# Altium project brew.PrjPcb
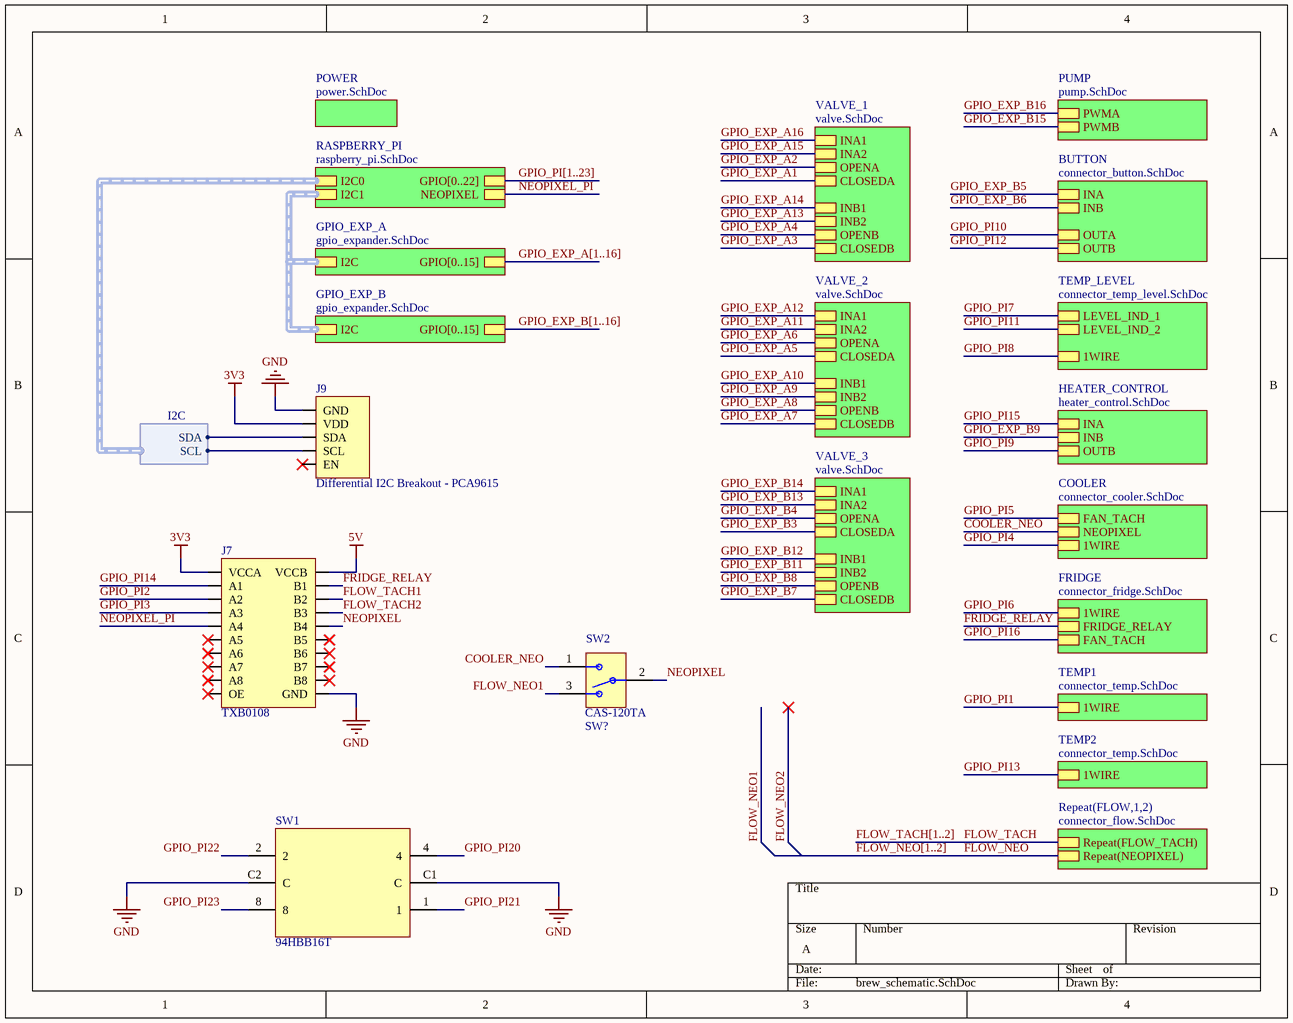
[diagram p0: brew_schematic.SchDoc]
15 sheets, 45 parts. Net scope: hierarchical (ports join the sheet entries above them; power ports are global).
Board file: brew_cad.PcbDoc
Sheets:
  brew_schematic.SchDoc
    POWER = power.SchDoc
    RASPBERRY_PI = raspberry_pi.SchDoc
    PUMP = pump.SchDoc
      Pump Connector B = connector_pump.SchDoc
      Pump Connector A = connector_pump.SchDoc
    TEMP_LEVEL = connector_temp_level.SchDoc
    HEATER_CONTROL = heater_control.SchDoc
    COOLER = connector_cooler.SchDoc
    GPIO_EXP_A = gpio_expander.SchDoc
    GPIO_EXP_B = gpio_expander.SchDoc
    FRIDGE = connector_fridge.SchDoc
    TEMP1 = connector_temp.SchDoc
    FLOW1 = connector_flow.SchDoc
    FLOW2 = connector_flow.SchDoc
    BUTTON = connector_button.SchDoc
    VALVE_1 = valve.SchDoc
      VALVE_CONN = connector_valve.SchDoc
      VALVE_CONN = connector_valve.SchDoc
    VALVE_2 = valve.SchDoc
      VALVE_CONN = connector_valve.SchDoc
      VALVE_CONN = connector_valve.SchDoc
    VALVE_3 = valve.SchDoc
      VALVE_CONN = connector_valve.SchDoc
      VALVE_CONN = connector_valve.SchDoc
    TEMP2 = connector_temp.SchDoc

## Sheet brew_schematic.SchDoc: Monk
size A

### Parts
J7  TXB0108  [TXB0108]
J9  Differential I2C Breakout - PCA9615  [Differential I2C Breakout - PCA9615]
SW1  MFG P/N: 94HBB16T  [SW_HEX_ROTARY_94HBB16T]  (hidden comment: SWITCH_HEX ROTARY_50V_DIP16)
SW2  MFG P/N: CAS-120TA  Designator: SW?  [SWITCH_CAS-120TA]  (hidden comment: SWITCH_DIP_SPDT_CAS-120TA)

### Sub-sheets
BUTTON = connector_button.SchDoc: INA, INB, OUTB, OUTA
COOLER = connector_cooler.SchDoc: NEOPIXEL, FAN_TACH, 1WIRE
FRIDGE = connector_fridge.SchDoc: FRIDGE_RELAY, 1WIRE, FAN_TACH
GPIO_EXP_A = gpio_expander.SchDoc: GPIO[0..15], I2C (harness I2C)
GPIO_EXP_B = gpio_expander.SchDoc: GPIO[0..15], I2C (harness I2C)
HEATER_CONTROL = heater_control.SchDoc: INA, INB, OUTB
POWER = power.SchDoc: no entries
PUMP = pump.SchDoc: PWMB, PWMA
RASPBERRY_PI = raspberry_pi.SchDoc: I2C1 (harness I2C), I2C0 (harness I2C), GPIO[0..22], NEOPIXEL
Repeat(FLOW,1,2) = connector_flow.SchDoc: Repeat(FLOW_TACH), Repeat(NEOPIXEL)
TEMP1 = connector_temp.SchDoc: 1WIRE
TEMP2 = connector_temp.SchDoc: 1WIRE
TEMP_LEVEL = connector_temp_level.SchDoc: 1WIRE, LEVEL_IND_2, LEVEL_IND_1
VALVE_1 = valve.SchDoc: CLOSEDB, INA2, OPENB, OPENA, CLOSEDA, INB2, INB1, INA1
VALVE_2 = valve.SchDoc: CLOSEDB, INA2, OPENB, OPENA, CLOSEDA, INB2, INB1, INA1
VALVE_3 = valve.SchDoc: CLOSEDB, INA2, OPENB, OPENA, CLOSEDA, INB2, INB1, INA1

### Harnesses
I2C: SDA, SCL

### Nets
3V3: J7.1(VCCA) J9.2(VDD)
5V: J7.20(VCCB)
GND: J7.11(GND) J9.1(GND) SW1.C1(C) SW1.C2(C)
COOLER_NEO: SW2.1 ; sheet COOLER/NEOPIXEL
FLOW_NEO: sheet Repeat(FLOW,1,2)/Repeat(NEOPIXEL)
FLOW_NEO1: SW2.3
FLOW_TACH: sheet Repeat(FLOW,1,2)/Repeat(FLOW_TACH)
FLOW_TACH1: J7.18(B2)
FLOW_TACH2: J7.17(B3)
FRIDGE_RELAY: J7.19(B1) ; sheet FRIDGE/FRIDGE_RELAY
GPIO_PI2: J7.3(A2)  [project net GPIO1]
GPIO_PI3: J7.4(A3)  [project net GPIO2]
GPIO_PI14: J7.2(A1)  [project net GPIO13]
GPIO_PI20: SW1.4  [project net GPIO19]
GPIO_PI21: SW1.1  [project net GPIO20]
GPIO_PI22: SW1.2  [project net GPIO21]
GPIO_PI23: SW1.8  [project net GPIO22]
I2C0_SCL: J9.4(SCL) ; sheet RASPBERRY_PI/I2C0.SCL
I2C0_SDA: J9.3(SDA) ; sheet RASPBERRY_PI/I2C0.SDA
NEOPIXEL: J7.16(B4) SW2.2
NEOPIXEL_PI: J7.5(A4) ; sheet RASPBERRY_PI/NEOPIXEL

Not connected (* = marked no-connect by the designer): J7 6(A5)* 7(A6)* 8(A7)* 9(A8)* 10(OE)* 12(B8)* 13(B7)* 14(B6)* 15(B5)*; J9 5(EN)*

### Buses and harness runs
bus FLOW_NEO[1..2]
bus FLOW_TACH[1..2]
bus GPIO_EXP_A[1..16] = sheet GPIO_EXP_A/GPIO[0..15]
bus GPIO_EXP_B[1..16] = sheet GPIO_EXP_B/GPIO[0..15]
bus GPIO_PI[1..23] = sheet RASPBERRY_PI/GPIO[0..22]
harness sheet GPIO_EXP_A/I2C = sheet GPIO_EXP_B/I2C = sheet RASPBERRY_PI/I2C1

### Library data of the parts
SW1 = 89: SWITCH ROTARY DIP HEX 100MA 50V; ID: 89; MFG: GRAYHILL; COMMON: 510-00168-00; XPN: XS-10020997; Status: In Development; ComponentLink1Description: Datasheet; ComponentLink1URL: http://www.digikey.com/products/en?keywords=94HBB16T; LOON: 510-00168-00; Gecko: 510-00168-00
SW2 = 38: SLIDE SWITCH SPDT J HOOK 6V; ID: 38; MFG: Copal Electronics Inc; COMMON: 510-00158-00; XPN: XS-10020994; Status: In Development; Category: Switches; RoHS Compliant: Yes; Supplier 1: Digi-Key; Mounting Type: Surface Mount; HelpURL: http://copal-electronics.info/en/0008e/02462.pdf; ComponentLink1Description: Datasheet; ComponentLink1URL: http://copal-electronics.info/en/0008e/02462.pdf; LOON: 510-00158-00; Gecko: 510-00158-00; Supplier Part Number 1: CAS120JCT-ND

## Sheet power.SchDoc
size A
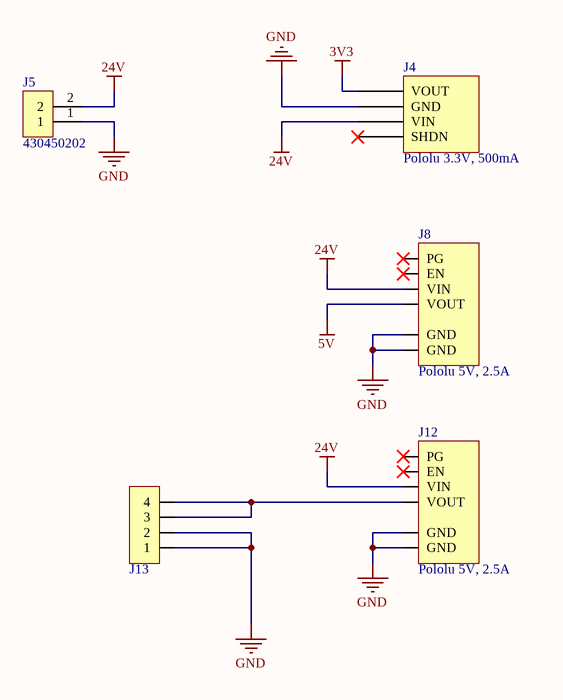
[diagram p1: power.SchDoc]

### Parts
J4  Pololu 3.3V, 500mA  [Pololu 3.3V, 500mA Step-Down Voltage Regulator D24V5F3 - duplicate]
J5  MFG P/N: 430450202  [MOLEX_430450202]  (hidden comment: __Template_Connector_1X2)
J8  Pololu 5V, 2.5A  [Pololu 5V, 2.5A Step-Down Voltage Regulator D24V22F5]
J12  Pololu 5V, 2.5A  [Pololu 5V, 2.5A Step-Down Voltage Regulator D24V22F5]
J13  1x4_PIN  [1x4_PIN]  (value not drawn)

### Nets
3V3: J4.1(VOUT)
5V: J8.5(VOUT)
24V: J4.3(VIN) J5.2 J8.3(VIN) J12.3(VIN)
GND: J4.2(GND) J5.1 J8.4(GND) J8.6(GND) J12.4(GND) J12.6(GND) J13.1 J13.2
NetJ12_5: J12.5(VOUT) J13.3 J13.4

Not connected (* = marked no-connect by the designer): J4 4(SHDN)*; J8 1(PG)* 2(EN)*; J12 1(PG)* 2(EN)*

### Library data of the parts
J4 = Pololu 3.3V, 500mA Step-Down Voltage Regulator D24V5F3
J5 = 958: CONN, HDR, R/A, 2x1, 3MM P, 7.37MM H, GOLD, TH; ID: 958; MFG: Molex, LLC; Connector Type: Header; Pitch: 3.00mm; Number of Positions: 2; Gender: Male; Current Rating: 8A; Voltage, Rated: 600V; Status: Released; RoHS Compliant: Yes; Mounting Type: Through Hole; Orientation: Right Angle; Number of Rows: 1; Features: Board Lock; Supplier 1: Digi-Key; HelpURL: https://www.digikey.in/product-detail/en/molex-llc/0430450202/WM1819-ND/252532; ComponentLink1Description: Datasheet; ComponentLink1URL: https://www.molex.com/pdm_docs/sd/430450202_sd.pdf; Supplier Part Number 1: WM1819-ND
J8 J12 = Pololu 5V, 2.5A Step-Down Voltage Regulator D24V22F5

## Sheet raspberry_pi.SchDoc
size A
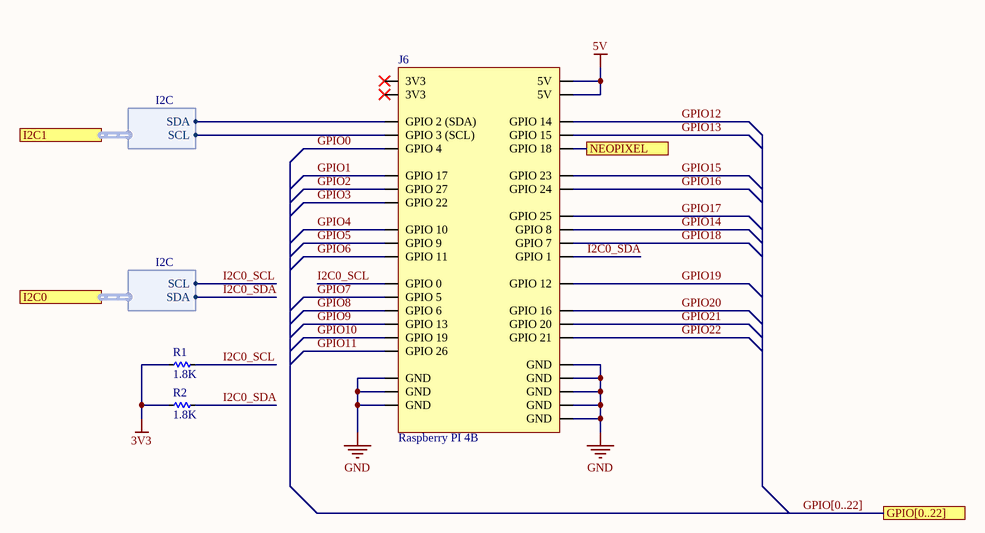
[diagram p2: raspberry_pi.SchDoc]

### Parts
J6  Raspberry PI 4B  [Raspberry PI 4B]
R1  value 1.8K  [R1206]  (hidden comment: __Template_Resistor)
R2  value 1.8K  [R1206]  (hidden comment: __Template_Resistor)

### Ports
GPIO[0..22], I2C0 (harness I2C), I2C1 (harness I2C), NEOPIXEL

### Harnesses
I2C: SDA, SCL

### Nets
3V3: R1.1 R2.1
5V: J6.2(5V) J6.4(5V)
GND: J6.6(GND) J6.9(GND) J6.14(GND) J6.20(GND) J6.25(GND) J6.30(GND) J6.34(GND) J6.39(GND)
GPIO0: J6.7(GPIO_4)
GPIO1: J6.11(GPIO_17)
GPIO2: J6.13(GPIO_27)
GPIO3: J6.15(GPIO_22)
GPIO4: J6.19(GPIO_10)
GPIO5: J6.21(GPIO_9)
GPIO6: J6.23(GPIO_11)
GPIO7: J6.29(GPIO_5)
GPIO8: J6.31(GPIO_6)
GPIO9: J6.33(GPIO_13)
GPIO10: J6.35(GPIO_19)
GPIO11: J6.37(GPIO_26)
GPIO12: J6.8(GPIO_14)
GPIO13: J6.10(GPIO_15)
GPIO14: J6.24(GPIO_8)
GPIO15: J6.16(GPIO_23)
GPIO16: J6.18(GPIO_24)
GPIO17: J6.22(GPIO_25)
GPIO18: J6.26(GPIO_7)
GPIO19: J6.32(GPIO_12)
GPIO20: J6.36(GPIO_16)
GPIO21: J6.38(GPIO_20)
GPIO22: J6.40(GPIO_21)
I2C0_SCL: J6.27(GPIO_0) R1.2 ; port I2C0.SCL
I2C0_SDA: J6.28(GPIO_1) R2.2 ; port I2C0.SDA
NEOPIXEL_PI: J6.12(GPIO_18) ; port NEOPIXEL
SCL: J6.5(GPIO_3_(SCL)) ; port I2C1.SCL
SDA: J6.3(GPIO_2_(SDA)) ; port I2C1.SDA

Not connected (* = marked no-connect by the designer): J6 1(3V3)* 17(3V3)*

### Buses and harness runs
bus GPIO[0..22] = port GPIO[0..22]

### Library data of the parts
R1 R2 = 3502: Resistor, 1.80K Ohms, 1206, 0.25W, ±1%; ID: 3502; MFG: YAGEO; MFG P/N: RC1206FR-071K8L; Power: 1/4W; COMMON: 470-06908-00; XPN: XS-10017648; Status: Released; Package: 1206; Tolerance: 1%; Height: 0.65mm; Supplier 1: Digi-Key; LOON: 470-06908-00; Gecko: 470-06908-00; Supplier Part Number 1: 311-1.80KFRCT-ND

## Sheet pump.SchDoc
size A
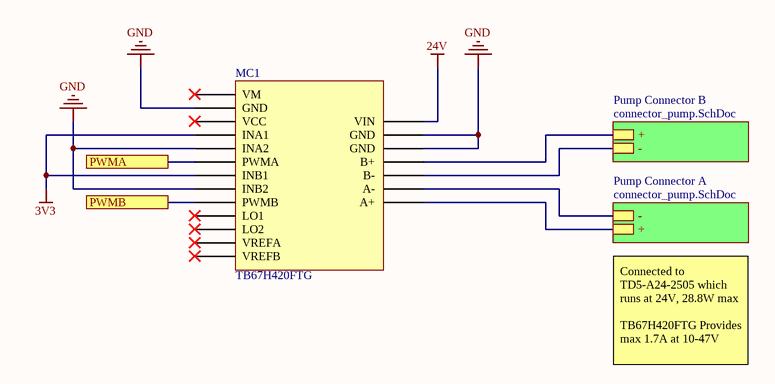
[diagram p3: pump.SchDoc]

### Parts
MC1  TB67H420FTG  [TB67H420FTG Dual/Single Motor Driver Carrier]

### Sub-sheets
Pump Connector A = connector_pump.SchDoc: +, -
Pump Connector B = connector_pump.SchDoc: +, -

### Ports
PWMA, PWMB

### Nets
3V3: MC1.4(INA1) MC1.7(INB1)
24V: MC1.20(VIN)
GND: MC1.2(GND) MC1.5(INA2) MC1.8(INB2) MC1.18(GND) MC1.19(GND)
GPIO14: MC1.9(PWMB) ; port PWMB
GPIO15: MC1.6(PWMA) ; port PWMA
NetCN1_Pump_Connector_A_1: MC1.14(A+) ; sheet Pump Connector A/+
NetCN1_Pump_Connector_A_2: MC1.15(A-) ; sheet Pump Connector A/-
NetCN1_Pump_Connector_B_1: MC1.17(B+) ; sheet Pump Connector B/+
NetCN1_Pump_Connector_B_2: MC1.16(B-) ; sheet Pump Connector B/-

Not connected (* = marked no-connect by the designer): MC1 1(VM)* 3(VCC)* 10(LO1)* 11(LO2)* 12(VREFA)* 13(VREFB)*

### Notes on the sheet
- Connected to TD5-A24-2505 which runs at 24V, 28.8W max
  TB67H420FTG Provides max 1.7A at 10-47V

### Library data of the parts
MC1 = TB67H420FTG Dual/Single Motor Driver Carrier

## Sheet connector_pump.SchDoc
size A
Used 2 times, as channels PUMP/Pump Connector B, PUMP/Pump Connector A. Parts and nets are listed once, with the designators drawn on the sheet.
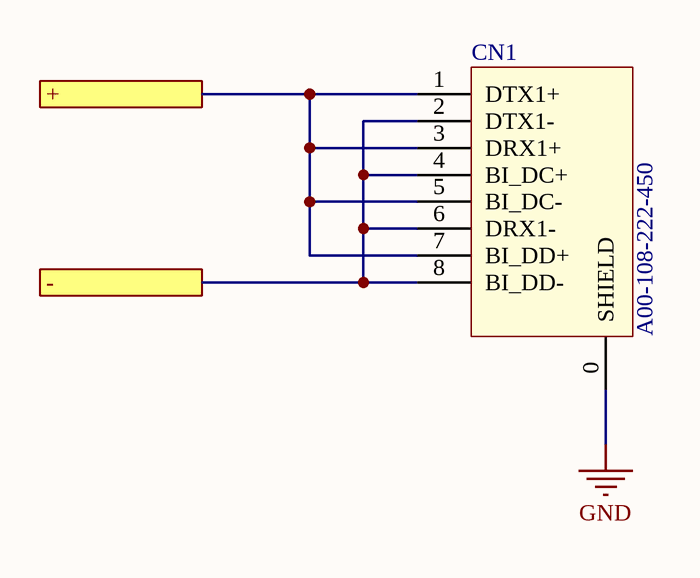
[diagram p4: connector_pump.SchDoc]

### Parts
CN1  MFG P/N: A00-108-222-450  [RJ45 TOP ENTRY EDAC A00-108-222-450]  (hidden comment: CONN_RJ45_TOP_A00-108-222-450)

### Ports
+, -

### Nets
GND: CN1.0(SHIELD)
+: CN1.1(DTX1+) CN1.3(DRX1+) CN1.5(BI_DC-) CN1.7(BI_DD+) ; port +
-: CN1.2(DTX1-) CN1.4(BI_DC+) CN1.6(DRX1-) CN1.8(BI_DD-) ; port -

### Channels
PUMP/Pump Connector B: designators end in _Pump_Connector_B; ports +=NetCN1_Pump_Connector_B_1 -=NetCN1_Pump_Connector_B_2
PUMP/Pump Connector A: designators end in _Pump_Connector_A; ports +=NetCN1_Pump_Connector_A_1 -=NetCN1_Pump_Connector_A_2

### Library data of the parts
CN1 = 492: CONN, RJ-45, 1-PORT, 8-POS, VERT, 0.76um GOLD, TH; ID: 492; MFG: EDAC Inc; COMMON: 210-00203-00; XPN: XS-10003929; Status: In Development; RoHS Compliant: Yes; LOON: 210-00203-00; Gecko: 210-00203-00

## Sheet connector_temp_level.SchDoc
size A
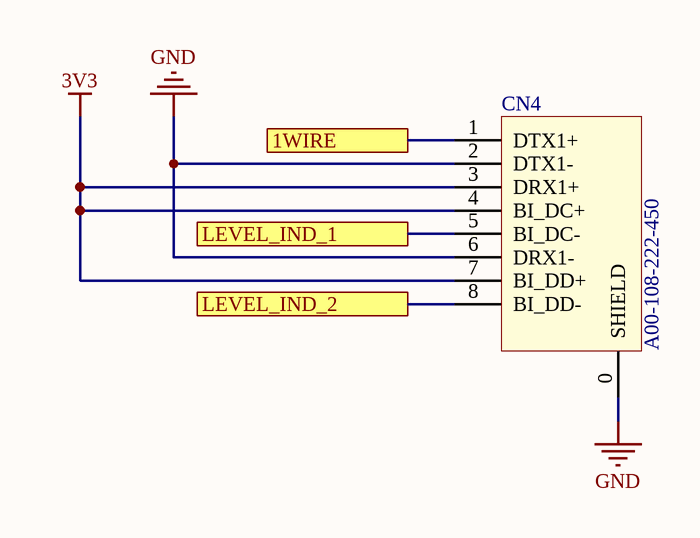
[diagram p5: connector_temp_level.SchDoc]

### Parts
CN4  MFG P/N: A00-108-222-450  [RJ45 TOP ENTRY EDAC A00-108-222-450]  (hidden comment: CONN_RJ45_TOP_A00-108-222-450)

### Ports
1WIRE, LEVEL_IND_1, LEVEL_IND_2

### Nets
3V3: CN4.3(DRX1+) CN4.4(BI_DC+) CN4.7(BI_DD+)
GND: CN4.0(SHIELD) CN4.2(DTX1-) CN4.6(DRX1-)
GPIO6: CN4.5(BI_DC-) ; port LEVEL_IND_1
GPIO7: CN4.1(DTX1+) ; port 1WIRE
GPIO10: CN4.8(BI_DD-) ; port LEVEL_IND_2

### Library data of the parts
CN4 = 492: as CN1 on sheet connector_pump; Status: In Development; RoHS Compliant: Yes; LOON: 210-00203-00; Gecko: 210-00203-00

## Sheet heater_control.SchDoc
size A
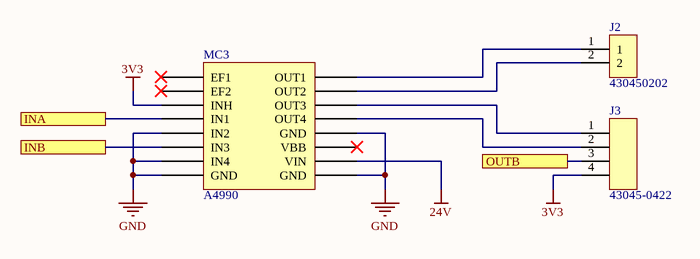
[diagram p6: heater_control.SchDoc]

### Parts
J2  MFG P/N: 430450202  [MOLEX_430450202]  (hidden comment: __Template_Connector_1X2)
J3  MFG P/N: 43045-0422  [MOLEX_MICROFIT_DOUBLE_ROW_RA_TH_4POS_43045-0422]  (hidden comment: CONN_MOLEX_MICROFIT_DOUBLE_ROW_RA_TH_4POS_LOCK)
MC3  A4990  [A4990 Dual Motor Driver Carrier]

### Ports
INA, INB, OUTB

### Nets
3V3: J3.4 MC3.3(INH)
24V: MC3.10(VIN)
GND: MC3.5(IN2) MC3.7(IN4) MC3.8(GND) MC3.9(GND) MC3.12(GND)
GPIO8: J3.3 ; port OUTB
GPIO8: MC3.6(IN3) ; port INB  [a separate net that carries the same name]
GPIO14: MC3.4(IN1) ; port INA
NetJ2_1: J2.1 MC3.16(OUT1)
NetJ2_2: J2.2 MC3.15(OUT2)
NetJ3_1: J3.1 MC3.14(OUT3)
NetJ3_2: J3.2 MC3.13(OUT4)

Not connected (* = marked no-connect by the designer): MC3 1(EF1)* 2(EF2)* 11(VBB)*

### Library data of the parts
J2 = 958: as J5 on sheet power; Status: Released; RoHS Compliant: Yes; Mounting Type: Through Hole; Orientation: Right Angle; Number of Rows: 1; Features: Board Lock; Supplier 1: Digi-Key; HelpURL: https://www.digikey.in/product-detail/en/molex-llc/0430450202/WM1819-ND/252532; ComponentLink1Description: Datasheet; ComponentLink1URL: https://www.molex.com/pdm_docs/sd/430450202_sd.pdf; Supplier Part Number 1: WM1819-ND
J3 = 164: CONN MOLEX MICROFIT 4POS RA GOLD; ID: 164; MFG: Molex Inc; Pitch: 3.00mm (0.118"); Number of Positions: 4; Gender: Male; COMMON: 210-00301-00; Status: In-Development; RoHS Compliant: Yes; Mounting Type: Through Hole; Orientation: Right Angle; Number of Rows: 2; Row Spacing: 3.00mm (0.118"); Features: Board Lock, Locking Ramp, Shrouded; Supplier 1: Digi-Key; HelpURL: http://www.molex.com/pdm_docs/sd/430450221_sd.pdf; ComponentLink1Description: Datasheet; ComponentLink1URL: http://www.molex.com/pdm_docs/sd/430450221_sd.pdf; LOON: 210-00301-00; XPN: 210-00301-00; Gecko: 210-00301-00
MC3 = A4990 Dual Motor Driver Carrier

## Sheet connector_cooler.SchDoc
size A
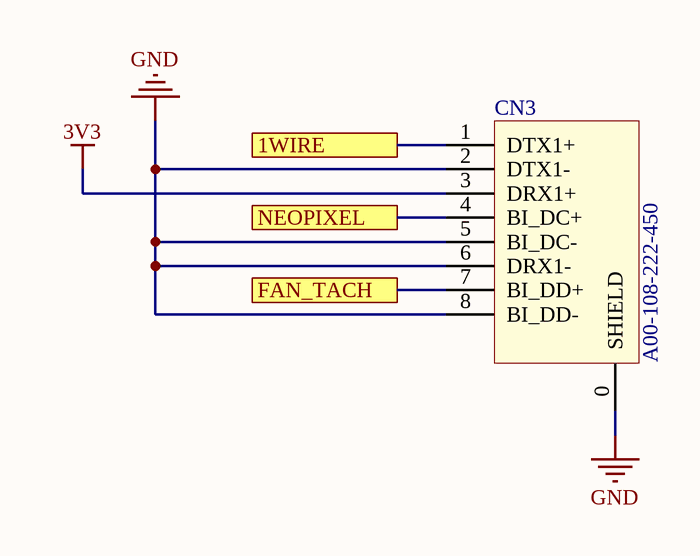
[diagram p7: connector_cooler.SchDoc]

### Parts
CN3  MFG P/N: A00-108-222-450  [RJ45 TOP ENTRY EDAC A00-108-222-450]  (hidden comment: CONN_RJ45_TOP_A00-108-222-450)

### Ports
1WIRE, FAN_TACH, NEOPIXEL

### Nets
3V3: CN3.3(DRX1+)
GND: CN3.0(SHIELD) CN3.2(DTX1-) CN3.5(BI_DC-) CN3.6(DRX1-) CN3.8(BI_DD-)
COOLER_NEO: CN3.4(BI_DC+) ; port NEOPIXEL
GPIO3: CN3.1(DTX1+) ; port 1WIRE
GPIO4: CN3.7(BI_DD+) ; port FAN_TACH

### Library data of the parts
CN3 = 492: as CN1 on sheet connector_pump; Status: In Development; RoHS Compliant: Yes; LOON: 210-00203-00; Gecko: 210-00203-00

## Sheet gpio_expander.SchDoc
size A
Used 2 times, as channels GPIO_EXP_A, GPIO_EXP_B. Parts and nets are listed once, with the designators drawn on the sheet.
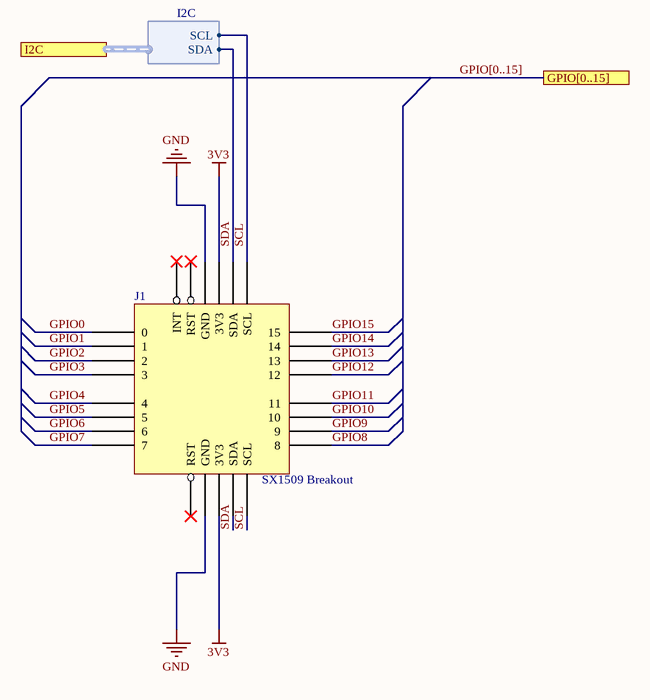
[diagram p8: gpio_expander.SchDoc]

### Parts
J1  SX1509 Breakout  [SX1509 Breakout]

### Ports
GPIO[0..15], I2C (harness I2C)

### Harnesses
I2C: SCL, SDA

### Nets
3V3: J1.11(3V3) J1.24(3V3)
GND: J1.10(GND) J1.25(GND)
GPIO0: J1.1(0)
GPIO1: J1.2(1)
GPIO2: J1.3(2)
GPIO3: J1.4(3)
GPIO4: J1.5(4)
GPIO5: J1.6(5)
GPIO6: J1.7(6)
GPIO7: J1.8(7)
GPIO8: J1.14(8)
GPIO9: J1.15(9)
GPIO10: J1.16(10)
GPIO11: J1.17(11)
GPIO12: J1.18(12)
GPIO13: J1.19(13)
GPIO14: J1.20(14)
GPIO15: J1.21(15)
SCL: J1.13(SCL) J1.22(SCL) ; port I2C.SCL
SDA: J1.12(SDA) J1.23(SDA) ; port I2C.SDA

Not connected (* = marked no-connect by the designer): J1 9(RST)* 26(RST)* 27(INT)*

### Channels
GPIO_EXP_A: designators end in _GPIO_EXP_A
GPIO_EXP_B: designators end in _GPIO_EXP_B

### Buses and harness runs
bus GPIO[0..15] = port GPIO[0..15]

## Sheet connector_fridge.SchDoc
size A
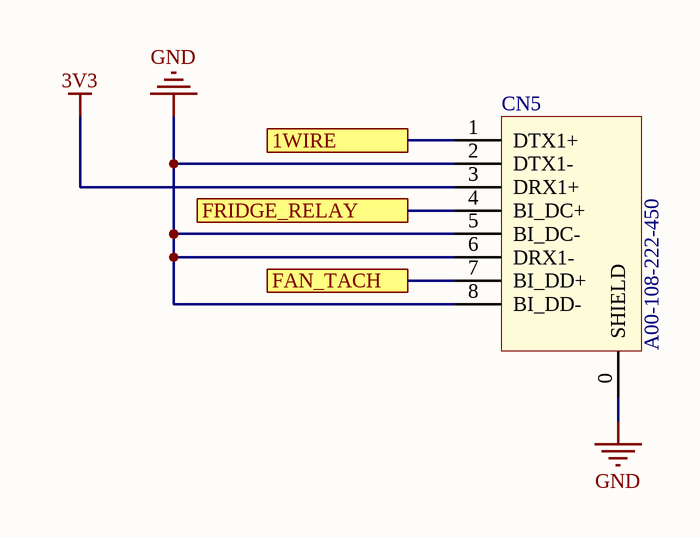
[diagram p9: connector_fridge.SchDoc]

### Parts
CN5  MFG P/N: A00-108-222-450  [RJ45 TOP ENTRY EDAC A00-108-222-450]  (hidden comment: CONN_RJ45_TOP_A00-108-222-450)

### Ports
1WIRE, FAN_TACH, FRIDGE_RELAY

### Nets
3V3: CN5.3(DRX1+)
GND: CN5.0(SHIELD) CN5.2(DTX1-) CN5.5(BI_DC-) CN5.6(DRX1-) CN5.8(BI_DD-)
FRIDGE_RELAY: CN5.4(BI_DC+) ; port FRIDGE_RELAY
GPIO5: CN5.1(DTX1+) ; port 1WIRE
GPIO15: CN5.7(BI_DD+) ; port FAN_TACH

### Library data of the parts
CN5 = 492: as CN1 on sheet connector_pump; Status: In Development; RoHS Compliant: Yes; LOON: 210-00203-00; Gecko: 210-00203-00

## Sheet connector_temp.SchDoc
size A
Used 2 times, as channels TEMP1, TEMP2. Parts and nets are listed once, with the designators drawn on the sheet.
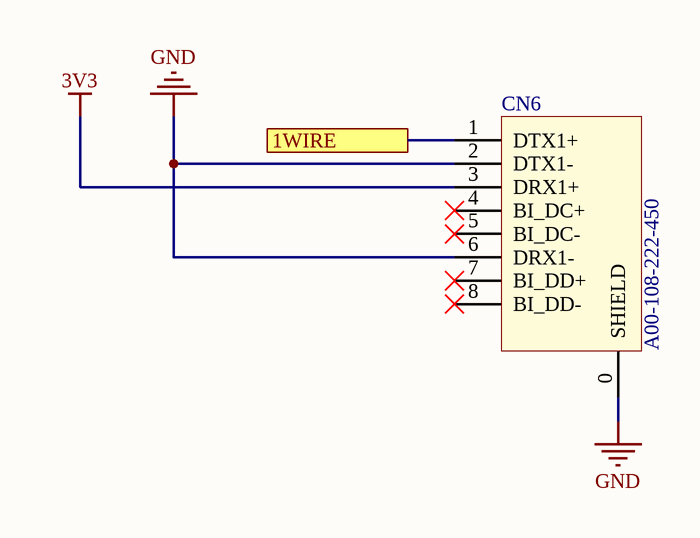
[diagram p10: connector_temp.SchDoc]

### Parts
CN6  MFG P/N: A00-108-222-450  [RJ45 TOP ENTRY EDAC A00-108-222-450]  (hidden comment: CONN_RJ45_TOP_A00-108-222-450)

### Ports
1WIRE

### Nets
3V3: CN6.3(DRX1+)
GND: CN6.0(SHIELD) CN6.2(DTX1-) CN6.6(DRX1-)
1WIRE: CN6.1(DTX1+) ; port 1WIRE

Not connected (* = marked no-connect by the designer): CN6 4(BI_DC+)* 5(BI_DC-)* 7(BI_DD+)* 8(BI_DD-)*

### Channels
TEMP1: designators end in _TEMP1; ports 1WIRE=GPIO0
TEMP2: designators end in _TEMP2; ports 1WIRE=GPIO12

### Library data of the parts
CN6 = 492: as CN1 on sheet connector_pump; Status: In Development; RoHS Compliant: Yes; LOON: 210-00203-00; Gecko: 210-00203-00

## Sheet connector_flow.SchDoc
size A
Used 2 times, as channels FLOW1, FLOW2. Parts and nets are listed once, with the designators drawn on the sheet.
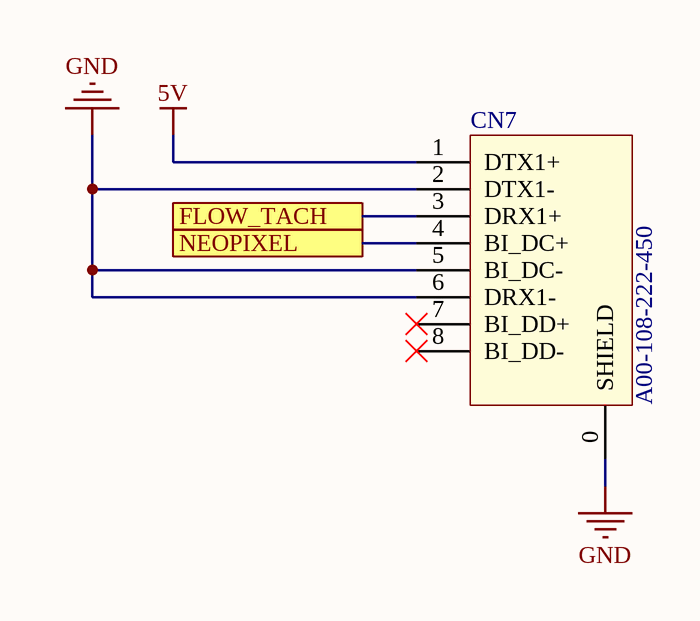
[diagram p11: connector_flow.SchDoc]

### Parts
CN7  MFG P/N: A00-108-222-450  [RJ45 TOP ENTRY EDAC A00-108-222-450]  (hidden comment: CONN_RJ45_TOP_A00-108-222-450)

### Ports
FLOW_TACH, NEOPIXEL

### Nets
5V: CN7.1(DTX1+)
GND: CN7.0(SHIELD) CN7.2(DTX1-) CN7.5(BI_DC-) CN7.6(DRX1-)
FLOW_TACH: CN7.3(DRX1+) ; port FLOW_TACH
NEOPIXEL: CN7.4(BI_DC+) ; port NEOPIXEL

Not connected (* = marked no-connect by the designer): CN7 7(BI_DD+)* 8(BI_DD-)*

### Channels
FLOW1: designators end in _FLOW1; ports FLOW_TACH=FLOW_TACH1 NEOPIXEL=FLOW_NEO1
FLOW2: designators end in _FLOW2; ports FLOW_TACH=FLOW_TACH2 NEOPIXEL=FLOW_NEO2

### Library data of the parts
CN7 = 492: as CN1 on sheet connector_pump; Status: In Development; RoHS Compliant: Yes; LOON: 210-00203-00; Gecko: 210-00203-00

## Sheet connector_button.SchDoc
size A
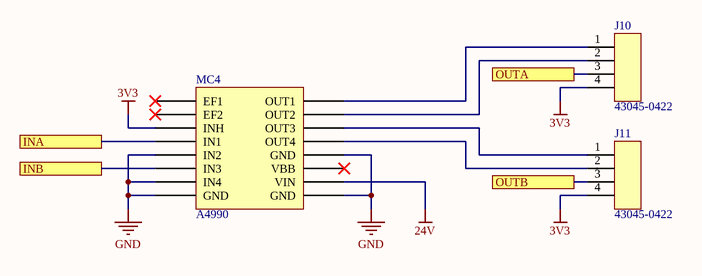
[diagram p12: connector_button.SchDoc]

### Parts
J10  MFG P/N: 43045-0422  [MOLEX_MICROFIT_DOUBLE_ROW_RA_TH_4POS_43045-0422]  (hidden comment: CONN_MOLEX_MICROFIT_DOUBLE_ROW_RA_TH_4POS_LOCK)
J11  MFG P/N: 43045-0422  [MOLEX_MICROFIT_DOUBLE_ROW_RA_TH_4POS_43045-0422]  (hidden comment: CONN_MOLEX_MICROFIT_DOUBLE_ROW_RA_TH_4POS_LOCK)
MC4  A4990  [A4990 Dual Motor Driver Carrier]

### Ports
INA, INB, OUTA, OUTB

### Nets
3V3: J10.4 J11.4 MC4.3(INH)
24V: MC4.10(VIN)
GND: MC4.5(IN2) MC4.7(IN4) MC4.8(GND) MC4.9(GND) MC4.12(GND)
GPIO4: MC4.4(IN1) ; port INA
GPIO5: MC4.6(IN3) ; port INB
GPIO9: J10.3 ; port OUTA
GPIO11: J11.3 ; port OUTB
NetJ10_1: J10.1 MC4.16(OUT1)
NetJ10_2: J10.2 MC4.15(OUT2)
NetJ11_1: J11.1 MC4.14(OUT3)
NetJ11_2: J11.2 MC4.13(OUT4)

Not connected (* = marked no-connect by the designer): MC4 1(EF1)* 2(EF2)* 11(VBB)*

### Library data of the parts
J10 J11 = 164: as J3 on sheet heater_control; Status: In-Development; RoHS Compliant: Yes; Mounting Type: Through Hole; Orientation: Right Angle; Number of Rows: 2; Row Spacing: 3.00mm (0.118"); Features: Board Lock, Locking Ramp, Shrouded; Supplier 1: Digi-Key; HelpURL: http://www.molex.com/pdm_docs/sd/430450221_sd.pdf; ComponentLink1Description: Datasheet; ComponentLink1URL: http://www.molex.com/pdm_docs/sd/430450221_sd.pdf; LOON: 210-00301-00; XPN: 210-00301-00; Gecko: 210-00301-00
MC4 = A4990 Dual Motor Driver Carrier

## Sheet valve.SchDoc
size A
Used 3 times, as channels VALVE_1, VALVE_2, VALVE_3. Parts and nets are listed once, with the designators drawn on the sheet.
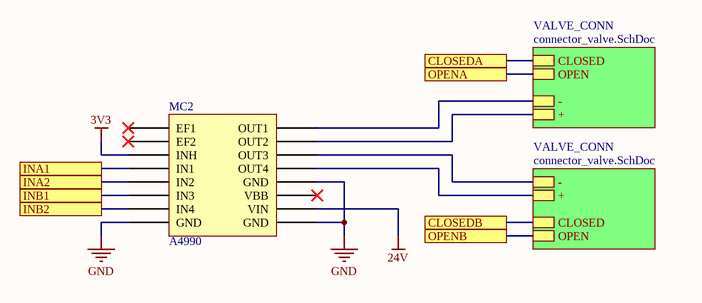
[diagram p13: valve.SchDoc]

### Parts
MC2  A4990  [A4990 Dual Motor Driver Carrier]

### Sub-sheets
VALVE_CONN = connector_valve.SchDoc: CLOSED, OPEN, -, +
VALVE_CONN = connector_valve.SchDoc: CLOSED, OPEN, -, +

### Ports
CLOSEDA, CLOSEDB, INA1, INA2, INB1, INB2, OPENA, OPENB

### Nets
3V3: MC2.3(INH)
24V: MC2.10(VIN)
GND: MC2.8(GND) MC2.9(GND) MC2.12(GND)
CLOSEDA: port CLOSEDA, sheet VALVE_CONN/CLOSED
CLOSEDB: port CLOSEDB, sheet VALVE_CONN/CLOSED
INA1: MC2.4(IN1) ; port INA1
INA2: MC2.5(IN2) ; port INA2
INB1: MC2.6(IN3) ; port INB1
INB2: MC2.7(IN4) ; port INB2
OPENA: port OPENA, sheet VALVE_CONN/OPEN
OPENB: port OPENB, sheet VALVE_CONN/OPEN
NetMC2_13: MC2.13(OUT4) ; sheet VALVE_CONN/+
NetMC2_14: MC2.14(OUT3) ; sheet VALVE_CONN/-
NetMC2_15: MC2.15(OUT2) ; sheet VALVE_CONN/+
NetMC2_16: MC2.16(OUT1) ; sheet VALVE_CONN/-

Not connected (* = marked no-connect by the designer): MC2 1(EF1)* 2(EF2)* 11(VBB)*

### Channels
VALVE_1: designators end in _VALVE_1; ports CLOSEDA=GPIO0 CLOSEDB=GPIO2 INA1=GPIO15 INA2=GPIO14 INB1=GPIO13 INB2=GPIO12 OPENA=GPIO1 OPENB=GPIO3
VALVE_2: designators end in _VALVE_2; ports CLOSEDA=GPIO4 CLOSEDB=GPIO6 INA1=GPIO11 INA2=GPIO10 INB1=GPIO9 INB2=GPIO8 OPENA=GPIO5 OPENB=GPIO7
VALVE_3: designators end in _VALVE_3; ports CLOSEDA=GPIO2 CLOSEDB=GPIO6 INA1=GPIO13 INA2=GPIO12 INB1=GPIO11 INB2=GPIO10 OPENA=GPIO3 OPENB=GPIO7

### Library data of the parts
MC2 = A4990 Dual Motor Driver Carrier

## Sheet connector_valve.SchDoc
size A
Used 6 times, as channels VALVE_1/VALVE_CONN, VALVE_1/VALVE_CONN, VALVE_2/VALVE_CONN, VALVE_2/VALVE_CONN, VALVE_3/VALVE_CONN, VALVE_3/VALVE_CONN. Parts and nets are listed once, with the designators drawn on the sheet.
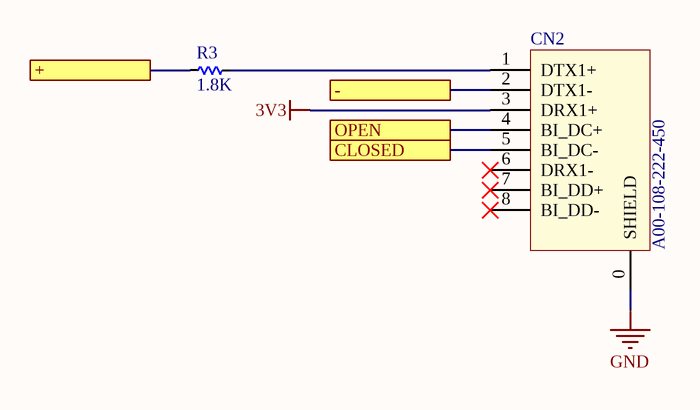
[diagram p14: connector_valve.SchDoc]

### Parts
CN2  MFG P/N: A00-108-222-450  [RJ45 TOP ENTRY EDAC A00-108-222-450]  (hidden comment: CONN_RJ45_TOP_A00-108-222-450)
R3  value 1.8K  [R1206]  (hidden comment: __Template_Resistor)

### Ports
+, -, CLOSED, OPEN

### Nets
3V3: CN2.3(DRX1+)
GND: CN2.0(SHIELD)
+: R3.1 ; port +
-: CN2.2(DTX1-) ; port -
CLOSED: CN2.5(BI_DC-) ; port CLOSED
OPEN: CN2.4(BI_DC+) ; port OPEN
NetCN2_1: CN2.1(DTX1+) R3.2

Not connected (* = marked no-connect by the designer): CN2 6(DRX1-)* 7(BI_DD+)* 8(BI_DD-)*

### Channels
VALVE_1/VALVE_CONN: designators end in _VALVE_1_VALVE_CONN#1; ports +=NetMC2_VALVE_1_13 -=NetCN2_VALVE_1_VALVE_CONN#1_2 CLOSED=GPIO2 OPEN=GPIO3
VALVE_1/VALVE_CONN: designators end in _VALVE_1_VALVE_CONN#2; ports +=NetMC2_VALVE_1_15 -=NetCN2_VALVE_1_VALVE_CONN#2_2 CLOSED=GPIO0 OPEN=GPIO1
VALVE_2/VALVE_CONN: designators end in _VALVE_2_VALVE_CONN#1; ports +=NetMC2_VALVE_2_13 -=NetCN2_VALVE_2_VALVE_CONN#1_2 CLOSED=GPIO6 OPEN=GPIO7
VALVE_2/VALVE_CONN: designators end in _VALVE_2_VALVE_CONN#2; ports +=NetMC2_VALVE_2_15 -=NetCN2_VALVE_2_VALVE_CONN#2_2 CLOSED=GPIO4 OPEN=GPIO5
VALVE_3/VALVE_CONN: designators end in _VALVE_3_VALVE_CONN#1; ports +=NetMC2_VALVE_3_13 -=NetCN2_VALVE_3_VALVE_CONN#1_2 CLOSED=GPIO6 OPEN=GPIO7
VALVE_3/VALVE_CONN: designators end in _VALVE_3_VALVE_CONN#2; ports +=NetMC2_VALVE_3_15 -=NetCN2_VALVE_3_VALVE_CONN#2_2 CLOSED=GPIO2 OPEN=GPIO3

### Library data of the parts
CN2 = 492: as CN1 on sheet connector_pump; Status: In Development; RoHS Compliant: Yes; LOON: 210-00203-00; Gecko: 210-00203-00
R3 = 3502: as R1 on sheet raspberry_pi; Status: Released; Package: 1206; Tolerance: 1%; Height: 0.65mm; Supplier 1: Digi-Key; LOON: 470-06908-00; Gecko: 470-06908-00; Supplier Part Number 1: 311-1.80KFRCT-ND

## Nets that join several sheets
3V3: brew_schematic (J7.1 J9.2), power (J4.1), raspberry_pi (R1.1 R2.1), pump (MC1.4 MC1.7), connector_temp_level (CN4.3 CN4.4 CN4.7), heater_control (J3.4 MC3.3), connector_cooler (CN3.3), GPIO_EXP_A (J1_GPIO_EXP_A.11 J1_GPIO_EXP_A.24), GPIO_EXP_B (J1_GPIO_EXP_B.11 J1_GPIO_EXP_B.24), connector_fridge (CN5.3), TEMP1 (CN6_TEMP1.3), connector_button (J10.4 J11.4 MC4.3), VALVE_1 (MC2_VALVE_1.3), VALVE_1/VALVE_CONN (CN2_VALVE_1_VALVE_CONN#1.3), VALVE_1/VALVE_CONN (CN2_VALVE_1_VALVE_CONN#2.3), VALVE_2 (MC2_VALVE_2.3), VALVE_2/VALVE_CONN (CN2_VALVE_2_VALVE_CONN#1.3), VALVE_2/VALVE_CONN (CN2_VALVE_2_VALVE_CONN#2.3), VALVE_3 (MC2_VALVE_3.3), VALVE_3/VALVE_CONN (CN2_VALVE_3_VALVE_CONN#1.3), VALVE_3/VALVE_CONN (CN2_VALVE_3_VALVE_CONN#2.3), TEMP2 (CN6_TEMP2.3)
5V: brew_schematic (J7.20), power (J8.5), raspberry_pi (J6.2 J6.4), FLOW1 (CN7_FLOW1.1), FLOW2 (CN7_FLOW2.1)
24V: power (J4.3 J5.2 J8.3 J12.3), pump (MC1.20), heater_control (MC3.10), connector_button (MC4.10), VALVE_1 (MC2_VALVE_1.10), VALVE_2 (MC2_VALVE_2.10), VALVE_3 (MC2_VALVE_3.10)
GND: brew_schematic (J7.11 J9.1 SW1.C1 SW1.C2), power (8 pins), raspberry_pi (8 pins), pump (5 pins), PUMP/Pump Connector B (CN1_Pump_Connector_B.0), PUMP/Pump Connector A (CN1_Pump_Connector_A.0), connector_temp_level (CN4.0 CN4.2 CN4.6), heater_control (5 pins), connector_cooler (5 pins), GPIO_EXP_A (J1_GPIO_EXP_A.10 J1_GPIO_EXP_A.25), GPIO_EXP_B (J1_GPIO_EXP_B.10 J1_GPIO_EXP_B.25), connector_fridge (5 pins), TEMP1 (CN6_TEMP1.0 CN6_TEMP1.2 CN6_TEMP1.6), FLOW1 (CN7_FLOW1.0 CN7_FLOW1.2 CN7_FLOW1.5 CN7_FLOW1.6), FLOW2 (CN7_FLOW2.0 CN7_FLOW2.2 CN7_FLOW2.5 CN7_FLOW2.6), connector_button (5 pins), VALVE_1 (MC2_VALVE_1.8 MC2_VALVE_1.9 MC2_VALVE_1.12), VALVE_1/VALVE_CONN (CN2_VALVE_1_VALVE_CONN#1.0), VALVE_1/VALVE_CONN (CN2_VALVE_1_VALVE_CONN#2.0), VALVE_2 (MC2_VALVE_2.8 MC2_VALVE_2.9 MC2_VALVE_2.12), VALVE_2/VALVE_CONN (CN2_VALVE_2_VALVE_CONN#1.0), VALVE_2/VALVE_CONN (CN2_VALVE_2_VALVE_CONN#2.0), VALVE_3 (MC2_VALVE_3.8 MC2_VALVE_3.9 MC2_VALVE_3.12), VALVE_3/VALVE_CONN (CN2_VALVE_3_VALVE_CONN#1.0), VALVE_3/VALVE_CONN (CN2_VALVE_3_VALVE_CONN#2.0), TEMP2 (CN6_TEMP2.0 CN6_TEMP2.2 CN6_TEMP2.6)
COOLER_NEO: brew_schematic (SW2.1), connector_cooler (CN3.4)
FLOW_NEO1: brew_schematic (SW2.3), FLOW1 (CN7_FLOW1.4)
FLOW_TACH1: brew_schematic (J7.18), FLOW1 (CN7_FLOW1.3)
FLOW_TACH2: brew_schematic (J7.17), FLOW2 (CN7_FLOW2.3)
FRIDGE_RELAY: brew_schematic (J7.19), connector_fridge (CN5.4)
GPIO0: raspberry_pi (J6.7), TEMP1 (CN6_TEMP1.1)
GPIO0: GPIO_EXP_A (J1_GPIO_EXP_A.1), VALVE_1/VALVE_CONN (CN2_VALVE_1_VALVE_CONN#2.5)
GPIO1: brew_schematic (J7.3), raspberry_pi (J6.11)
GPIO1: GPIO_EXP_A (J1_GPIO_EXP_A.2), VALVE_1/VALVE_CONN (CN2_VALVE_1_VALVE_CONN#2.4)
GPIO2: brew_schematic (J7.4), raspberry_pi (J6.13)
GPIO2: GPIO_EXP_A (J1_GPIO_EXP_A.3), VALVE_1/VALVE_CONN (CN2_VALVE_1_VALVE_CONN#1.5)
GPIO2: GPIO_EXP_B (J1_GPIO_EXP_B.3), VALVE_3/VALVE_CONN (CN2_VALVE_3_VALVE_CONN#2.5)
GPIO3: raspberry_pi (J6.15), connector_cooler (CN3.1)
GPIO3: GPIO_EXP_A (J1_GPIO_EXP_A.4), VALVE_1/VALVE_CONN (CN2_VALVE_1_VALVE_CONN#1.4)
GPIO3: GPIO_EXP_B (J1_GPIO_EXP_B.4), VALVE_3/VALVE_CONN (CN2_VALVE_3_VALVE_CONN#2.4)
GPIO4: raspberry_pi (J6.19), connector_cooler (CN3.7)
GPIO4: GPIO_EXP_A (J1_GPIO_EXP_A.5), VALVE_2/VALVE_CONN (CN2_VALVE_2_VALVE_CONN#2.5)
GPIO4: GPIO_EXP_B (J1_GPIO_EXP_B.5), connector_button (MC4.4)
GPIO5: raspberry_pi (J6.21), connector_fridge (CN5.1)
GPIO5: GPIO_EXP_A (J1_GPIO_EXP_A.6), VALVE_2/VALVE_CONN (CN2_VALVE_2_VALVE_CONN#2.4)
GPIO5: GPIO_EXP_B (J1_GPIO_EXP_B.6), connector_button (MC4.6)
GPIO6: raspberry_pi (J6.23), connector_temp_level (CN4.5)
GPIO6: GPIO_EXP_A (J1_GPIO_EXP_A.7), VALVE_2/VALVE_CONN (CN2_VALVE_2_VALVE_CONN#1.5)
GPIO6: GPIO_EXP_B (J1_GPIO_EXP_B.7), VALVE_3/VALVE_CONN (CN2_VALVE_3_VALVE_CONN#1.5)
GPIO7: raspberry_pi (J6.29), connector_temp_level (CN4.1)
GPIO7: GPIO_EXP_A (J1_GPIO_EXP_A.8), VALVE_2/VALVE_CONN (CN2_VALVE_2_VALVE_CONN#1.4)
GPIO7: GPIO_EXP_B (J1_GPIO_EXP_B.8), VALVE_3/VALVE_CONN (CN2_VALVE_3_VALVE_CONN#1.4)
GPIO8: raspberry_pi (J6.31), heater_control (J3.3)
GPIO8: heater_control (MC3.6), GPIO_EXP_B (J1_GPIO_EXP_B.14)
GPIO8: GPIO_EXP_A (J1_GPIO_EXP_A.14), VALVE_2 (MC2_VALVE_2.7)
GPIO9: raspberry_pi (J6.33), connector_button (J10.3)
GPIO9: GPIO_EXP_A (J1_GPIO_EXP_A.15), VALVE_2 (MC2_VALVE_2.6)
GPIO10: raspberry_pi (J6.35), connector_temp_level (CN4.8)
GPIO10: GPIO_EXP_A (J1_GPIO_EXP_A.16), VALVE_2 (MC2_VALVE_2.5)
GPIO10: GPIO_EXP_B (J1_GPIO_EXP_B.16), VALVE_3 (MC2_VALVE_3.7)
GPIO11: raspberry_pi (J6.37), connector_button (J11.3)
GPIO11: GPIO_EXP_A (J1_GPIO_EXP_A.17), VALVE_2 (MC2_VALVE_2.4)
GPIO11: GPIO_EXP_B (J1_GPIO_EXP_B.17), VALVE_3 (MC2_VALVE_3.6)
GPIO12: raspberry_pi (J6.8), TEMP2 (CN6_TEMP2.1)
GPIO12: GPIO_EXP_A (J1_GPIO_EXP_A.18), VALVE_1 (MC2_VALVE_1.7)
GPIO12: GPIO_EXP_B (J1_GPIO_EXP_B.18), VALVE_3 (MC2_VALVE_3.5)
GPIO13: brew_schematic (J7.2), raspberry_pi (J6.10)
GPIO13: GPIO_EXP_A (J1_GPIO_EXP_A.19), VALVE_1 (MC2_VALVE_1.6)
GPIO13: GPIO_EXP_B (J1_GPIO_EXP_B.19), VALVE_3 (MC2_VALVE_3.4)
GPIO14: raspberry_pi (J6.24), heater_control (MC3.4)
GPIO14: pump (MC1.9), GPIO_EXP_B (J1_GPIO_EXP_B.20)
GPIO14: GPIO_EXP_A (J1_GPIO_EXP_A.20), VALVE_1 (MC2_VALVE_1.5)
GPIO15: raspberry_pi (J6.16), connector_fridge (CN5.7)
GPIO15: pump (MC1.6), GPIO_EXP_B (J1_GPIO_EXP_B.21)
GPIO15: GPIO_EXP_A (J1_GPIO_EXP_A.21), VALVE_1 (MC2_VALVE_1.4)
GPIO19: brew_schematic (SW1.4), raspberry_pi (J6.32)
GPIO20: brew_schematic (SW1.1), raspberry_pi (J6.36)
GPIO21: brew_schematic (SW1.2), raspberry_pi (J6.38)
GPIO22: brew_schematic (SW1.8), raspberry_pi (J6.40)
I2C0_SCL: brew_schematic (J9.4), raspberry_pi (J6.27 R1.2)
I2C0_SDA: brew_schematic (J9.3), raspberry_pi (J6.28 R2.2)
NEOPIXEL_PI: brew_schematic (J7.5), raspberry_pi (J6.12)
NetCN1_Pump_Connector_A_1: pump (MC1.14), PUMP/Pump Connector A (CN1_Pump_Connector_A.1 CN1_Pump_Connector_A.3 CN1_Pump_Connector_A.5 CN1_Pump_Connector_A.7)
NetCN1_Pump_Connector_A_2: pump (MC1.15), PUMP/Pump Connector A (CN1_Pump_Connector_A.2 CN1_Pump_Connector_A.4 CN1_Pump_Connector_A.6 CN1_Pump_Connector_A.8)
NetCN1_Pump_Connector_B_1: pump (MC1.17), PUMP/Pump Connector B (CN1_Pump_Connector_B.1 CN1_Pump_Connector_B.3 CN1_Pump_Connector_B.5 CN1_Pump_Connector_B.7)
NetCN1_Pump_Connector_B_2: pump (MC1.16), PUMP/Pump Connector B (CN1_Pump_Connector_B.2 CN1_Pump_Connector_B.4 CN1_Pump_Connector_B.6 CN1_Pump_Connector_B.8)
NetCN2_VALVE_1_VALVE_CONN#1_2: VALVE_1 (MC2_VALVE_1.14), VALVE_1/VALVE_CONN (CN2_VALVE_1_VALVE_CONN#1.2)
NetCN2_VALVE_1_VALVE_CONN#2_2: VALVE_1 (MC2_VALVE_1.16), VALVE_1/VALVE_CONN (CN2_VALVE_1_VALVE_CONN#2.2)
NetCN2_VALVE_2_VALVE_CONN#1_2: VALVE_2 (MC2_VALVE_2.14), VALVE_2/VALVE_CONN (CN2_VALVE_2_VALVE_CONN#1.2)
NetCN2_VALVE_2_VALVE_CONN#2_2: VALVE_2 (MC2_VALVE_2.16), VALVE_2/VALVE_CONN (CN2_VALVE_2_VALVE_CONN#2.2)
NetCN2_VALVE_3_VALVE_CONN#1_2: VALVE_3 (MC2_VALVE_3.14), VALVE_3/VALVE_CONN (CN2_VALVE_3_VALVE_CONN#1.2)
NetCN2_VALVE_3_VALVE_CONN#2_2: VALVE_3 (MC2_VALVE_3.16), VALVE_3/VALVE_CONN (CN2_VALVE_3_VALVE_CONN#2.2)
NetMC2_VALVE_1_13: VALVE_1 (MC2_VALVE_1.13), VALVE_1/VALVE_CONN (R3_VALVE_1_VALVE_CONN#1.1)
NetMC2_VALVE_1_15: VALVE_1 (MC2_VALVE_1.15), VALVE_1/VALVE_CONN (R3_VALVE_1_VALVE_CONN#2.1)
NetMC2_VALVE_2_13: VALVE_2 (MC2_VALVE_2.13), VALVE_2/VALVE_CONN (R3_VALVE_2_VALVE_CONN#1.1)
NetMC2_VALVE_2_15: VALVE_2 (MC2_VALVE_2.15), VALVE_2/VALVE_CONN (R3_VALVE_2_VALVE_CONN#2.1)
NetMC2_VALVE_3_13: VALVE_3 (MC2_VALVE_3.13), VALVE_3/VALVE_CONN (R3_VALVE_3_VALVE_CONN#1.1)
NetMC2_VALVE_3_15: VALVE_3 (MC2_VALVE_3.15), VALVE_3/VALVE_CONN (R3_VALVE_3_VALVE_CONN#2.1)
SCL: raspberry_pi (J6.5), GPIO_EXP_A (J1_GPIO_EXP_A.13 J1_GPIO_EXP_A.22), GPIO_EXP_B (J1_GPIO_EXP_B.13 J1_GPIO_EXP_B.22)
SDA: raspberry_pi (J6.3), GPIO_EXP_A (J1_GPIO_EXP_A.12 J1_GPIO_EXP_A.23), GPIO_EXP_B (J1_GPIO_EXP_B.12 J1_GPIO_EXP_B.23)